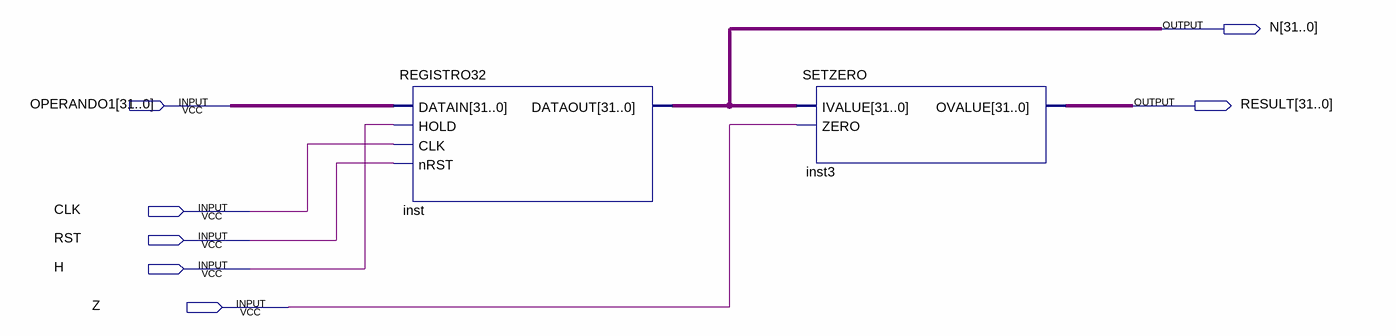
[diagram p0: schematic sheet]
// Quartus schematic TEST4.bdf as structural Verilog: 2 symbols, 7 pins
module TEST4 (
  input  [31:0] OPERANDO1,
  input  CLK,
  input  RST,
  input  H,
  input  Z,
  output [31:0] N,
  output [31:0] RESULT
);

  REGISTRO32 inst (.DATAIN(OPERANDO1), .HOLD(H), .CLK(CLK), .nRST(RST), .DATAOUT(N));
  SETZERO inst3 (.IVALUE(N), .ZERO(Z), .OVALUE(RESULT));
endmodule
